# EAGLE schematic circuit2 (EAGLE 9.6.2)
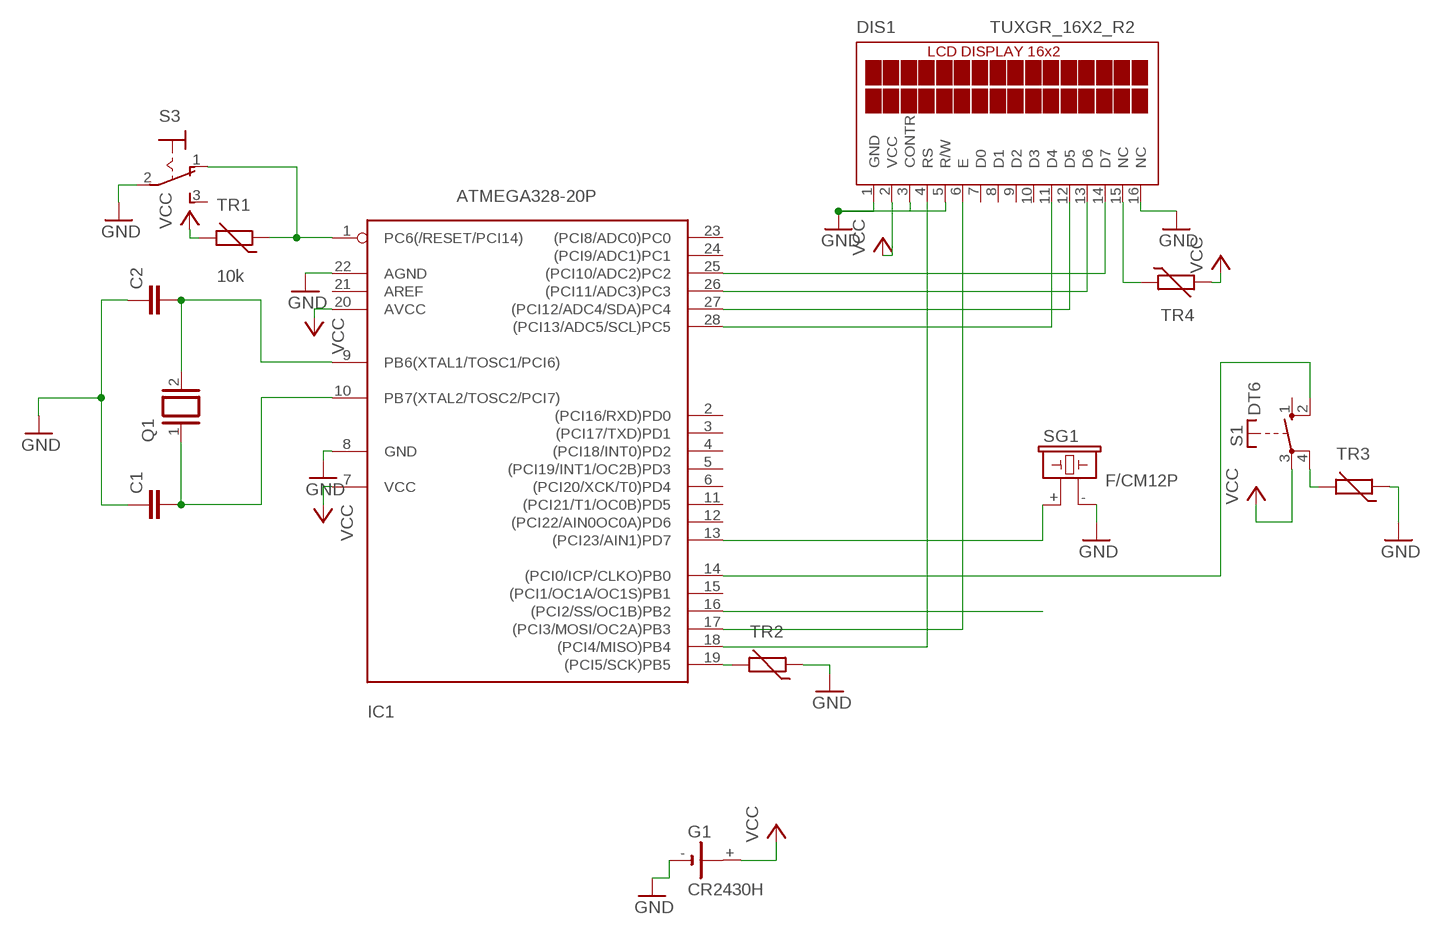
[diagram p0: schematic, sheet 1]

## Parts
C1  C2.5/2  [C2.5-2]
C2  C2.5/2  [C2.5-2]
DIS1  TUXGR_16X2_R2  [TUXGR_16X2_R2]
G1  CR2430H  [CR2430H]
IC1  ATMEGA328-20P  [DIL28-3]
Q1  XTAL/S  [QS]
S1  DT6  [DT6]
S3  320-916  [320-916]
SG1  F/CM12P  [F/CM12P]
TR1  10k  THERMISTOR_R-5  [R-5]
TR2  THERMISTOR_R-5  [R-5]
TR3  THERMISTOR_R-5  [R-5]
TR4  THERMISTOR_R-5  [R-5]

## Nets
GND [New Class]: C1.1 C2.1 DIS1.1(GND) DIS1.3(CONTR) DIS1.5(R/W) DIS1.16(NC) G1.- IC1.8(GND) IC1.22(AGND) S3.2(P) SG1.- TR2.1 TR3.1
N$1: IC1.13((PCI23/AIN1)PD7) SG1.+
N$4: IC1.1(PC6(/RESET/PCI14)) S3.1(O) TR1.1
N$5: C1.2 IC1.10(PB7(XTAL2/TOSC2/PCI7)) Q1.1
N$6: C2.2 IC1.9(PB6(XTAL1/TOSC1/PCI6)) Q1.2
N$7: IC1.19((PCI5/SCK)PB5) TR2.2
N$8: DIS1.15(NC) TR4.1
N$9: DIS1.4(RS) IC1.18((PCI4/MISO)PB4)
N$10: DIS1.6(E) IC1.17((PCI3/MOSI/OC2A)PB3)
N$11: DIS1.11(D4) IC1.28((PCI13/ADC5/SCL)PC5)
N$12: DIS1.12(D5) IC1.27((PCI12/ADC4/SDA)PC4)
N$13: DIS1.13(D6) IC1.26((PCI11/ADC3)PC3)
N$15: DIS1.14(D7) IC1.25((PCI10/ADC2)PC2)
N$16: IC1.16((PCI2/SS/OC1B)PB2)
N$17: S1.4(P) TR3.2
N$19: IC1.14((PCI0/ICP/CLKO)PB0) S1.2(S)
VCC [New Class]: DIS1.2(VCC) G1.+ IC1.7(VCC) IC1.20(AVCC) S1.3(P) TR1.2 TR4.2
Unconnected: DIS1.7(D0) DIS1.8(D1) DIS1.9(D2) DIS1.10(D3) G1.+@1(+) IC1.2((PCI16/RXD)PD0) IC1.3((PCI17/TXD)PD1) IC1.4((PCI18/INT0)PD2) IC1.5((PCI19/INT1/OC2B)PD3) IC1.6((PCI20/XCK/T0)PD4) IC1.11((PCI21/T1/OC0B)PD5) IC1.12((PCI22/AIN0OC0A)PD6) IC1.15((PCI1/OC1A/OC1S)PB1) IC1.21(AREF) IC1.23((PCI8/ADC0)PC0) IC1.24((PCI9/ADC1)PC1) S1.1(S) S3.3(S)

## Library data of the parts
C1 C2 = capacitor-wima:C: CAPACITOR naming: grid - package width
DIS1 = display-lcd:TUXGR_16X2_R2: Tuxgraphics LCD display 16x2 characters reflective, without background light Source: tuxgr_12x2_r2.pdf; OC_FARNELL: unknown; OC_NEWARK: unknown
G1 = battery:CR2430H: LI BATTERY Varta
IC1 = atmega328:ATMEGA328*P: MICROCONTROLLER 32 kBytes FLASH 2 kBytes SRAM 1 kBytes EEPROM USART 8-channel 10 bit ADC
Q1 = special:XTAL/S: CRYSTAL
S1 = switch-misc:DT: ITT SWITCH
S3 = switch:320-916: TOGGLE SWITCH distributor RS Components
SG1 = buzzer:F/CM12P: BUZZER Source: Buerklin; OC_FARNELL: unknown; OC_NEWARK: unknown
TR1-TR4 = discrete:THERMISTOR_: Thermo Resistor

## Net classes
0 default: width 0.5 mm
1 New Class: width 1.5 mm